# Altium schematic sheet High_Side_FETs.SchDoc
size A4; Organization: TESLA Motors, INC; Address1: 3500 Deer Creek Road; Address2: Palo Alto, CA; Address4: U.S.A.; SheetNumber: 5; SheetTotal: 8
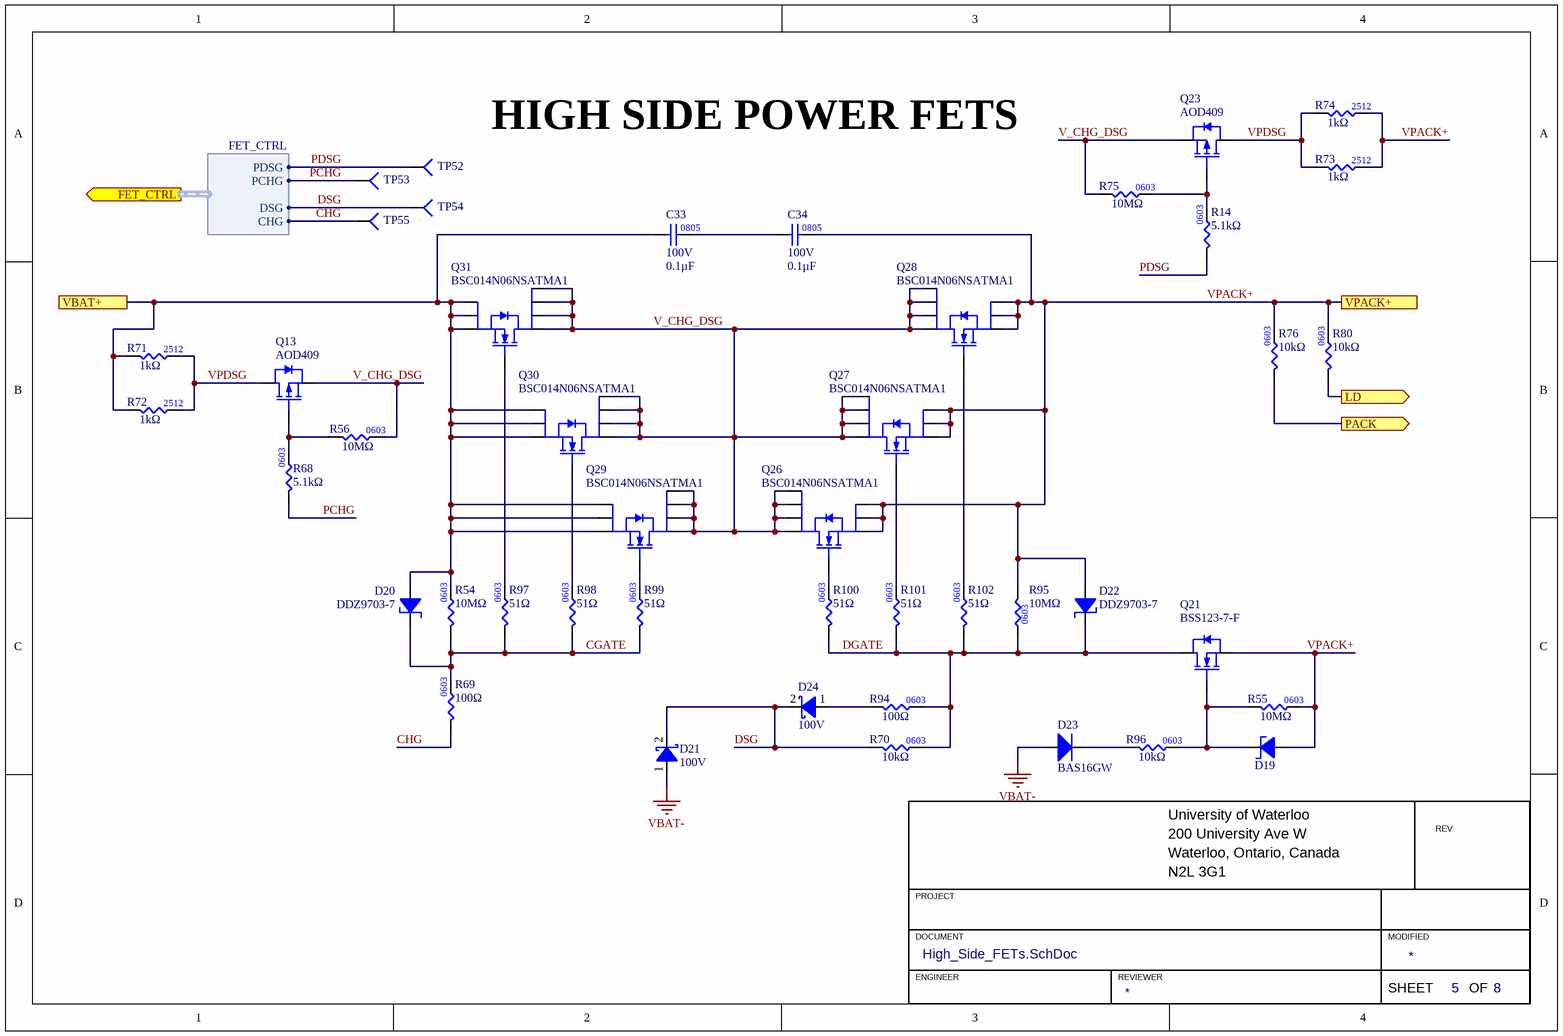
[diagram p0: High_Side_FETs.SchDoc]

## Parts
C33  value 0.1µF  Voltage Rating: 100V  [CAP0805]  (hidden comment: CAP_0.1uF_100V_0805)
C34  value 0.1µF  Voltage Rating: 100V  [CAP0805]  (hidden comment: CAP_0.1uF_100V_0805)
D19  DIO_ZENER_16V  [SOD-123_FLAT]  (value not drawn)
D20  Manufacturer Part Number 1: DDZ9703-7  [SOD-123_FLAT]  (hidden comment: DIO_ZENER_16V)
D21  Vr (Max): 100V  [SOD-123_FLAT]  (hidden comment: DIO_SCHOTTKY_100V_1A)
D22  Manufacturer Part Number 1: DDZ9703-7  [SOD-123_FLAT]  (hidden comment: DIO_ZENER_16V)
D23  Manufacturer Part Number 1: BAS16GW  [DIODSOD-123]  (hidden comment: DIO_100V_215mA)
D24  Vr (Max): 100V  [SOD-123_FLAT]  (hidden comment: DIO_SCHOTTKY_100V_1A)
Q13  Manufacturer Part Number 1: AOD409  [TO-252 AOSMD]  (hidden comment: PMOS_60V_26A)
Q21  Manufacturer Part Number 1: BSS123-7-F  [SOT23-3]  (hidden comment: NMOS_100V_170mA)
Q23  Manufacturer Part Number 1: AOD409  [TO-252 AOSMD]  (hidden comment: PMOS_60V_26A)
Q26  Manufacturer Part Number 1: BSC014N06NSATMA1  [INFINEON_8-POWERTDFN]  (hidden comment: NMOS_60V_30A)
Q27  Manufacturer Part Number 1: BSC014N06NSATMA1  [INFINEON_8-POWERTDFN]  (hidden comment: NMOS_60V_30A)
Q28  Manufacturer Part Number 1: BSC014N06NSATMA1  [INFINEON_8-POWERTDFN]  (hidden comment: NMOS_60V_30A)
Q29  Manufacturer Part Number 1: BSC014N06NSATMA1  [INFINEON_8-POWERTDFN]  (hidden comment: NMOS_60V_30A)
Q30  Manufacturer Part Number 1: BSC014N06NSATMA1  [INFINEON_8-POWERTDFN]  (hidden comment: NMOS_60V_30A)
Q31  Manufacturer Part Number 1: BSC014N06NSATMA1  [INFINEON_8-POWERTDFN]  (hidden comment: NMOS_60V_30A)
R14  value 5.1kΩ  [RES0603]  (hidden comment: RES_5.1kΩ_0603_1%)
R54  value 10MΩ  [RES0603]  (hidden comment: RES_10MΩ_0603_1%)
R55  value 10MΩ  [RES0603]  (hidden comment: RES_10MΩ_0603_1%)
R56  value 10MΩ  [RES0603]  (hidden comment: RES_10MΩ_0603_1%)
R68  value 5.1kΩ  [RES0603]  (hidden comment: RES_5.1kΩ_0603_1%)
R69  value 100Ω  [RES0603]  (hidden comment: RES_100Ω_0603_1%)
R70  value 10kΩ  [RES0603]  (hidden comment: RES_10kΩ_0603_1%)
R71  value 1kΩ  [RES2512]  (hidden comment: RES_1kΩ_2512_1%)
R72  value 1kΩ  [RES2512]  (hidden comment: RES_1kΩ_2512_1%)
R73  value 1kΩ  [RES2512]  (hidden comment: RES_1kΩ_2512_1%)
R74  value 1kΩ  [RES2512]  (hidden comment: RES_1kΩ_2512_1%)
R75  value 10MΩ  [RES0603]  (hidden comment: RES_10MΩ_0603_1%)
R76  value 10kΩ  [RES0603]  (hidden comment: RES_10kΩ_0603_1%)
R80  value 10kΩ  [RES0603]  (hidden comment: RES_10kΩ_0603_1%)
R94  value 100Ω  [RES0603]  (hidden comment: RES_100Ω_0603_1%)
R95  value 10MΩ  [RES0603]  (hidden comment: RES_10MΩ_0603_1%)
R96  value 10kΩ  [RES0603]  (hidden comment: RES_10kΩ_0603_1%)
R97  value 51Ω  [RES0603]  (hidden comment: RES_51Ω_0603_1%)
R98  value 51Ω  [RES0603]  (hidden comment: RES_51Ω_0603_1%)
R99  value 51Ω  [RES0603]  (hidden comment: RES_51Ω_0603_1%)
R100  value 51Ω  [RES0603]  (hidden comment: RES_51Ω_0603_1%)
R101  value 51Ω  [RES0603]  (hidden comment: RES_51Ω_0603_1%)
R102  value 51Ω  [RES0603]  (hidden comment: RES_51Ω_0603_1%)
TP52  TESTPOINT_1MM_CIRCLE  [TESTPOINT_CIRCLE_1MM]  (value not drawn)  (no BOM)
TP53  TESTPOINT_1MM_CIRCLE  [TESTPOINT_CIRCLE_1MM]  (value not drawn)  (no BOM)
TP54  TESTPOINT_1MM_CIRCLE  [TESTPOINT_CIRCLE_1MM]  (value not drawn)  (no BOM)
TP55  TESTPOINT_1MM_CIRCLE  [TESTPOINT_CIRCLE_1MM]  (value not drawn)  (no BOM)

## Ports
FET_CTRL (out, harness FET_CTRL), LD (out), PACK (out), VBAT+, VPACK+

## Harnesses
FET_CTRL: PDSG, PCHG, DSG, CHG

## Nets
VBAT-: D21.1(Anode) D23.1(A)
CGATE: D20.2(Cathode) R54.1 R69.2 R97.1 R98.1 R99.1
CHG: R69.1 TP55.1(=value) ; port FET_CTRL.CHG
DGATE: D22.2(Cathode) Q21.3(DRAIN) R70.2 R94.2 R95.1 R100.1 R101.1 R102.1
DSG: D21.2(Cathode) D24.2(Cathode) R70.1 TP54.1(=value) ; port FET_CTRL.DSG
LD: R80.1 ; port LD
PACK: R76.1 ; port PACK
PCHG: R68.1 TP53.1(=value) ; port FET_CTRL.PCHG
PDSG: R14.1 TP52.1(=value) ; port FET_CTRL.PDSG
V_CHG_DSG: Q13.3(Source) Q23.3(Source) Q26.5(Drain) Q26.6(Drain) Q26.7(Drain) Q26.8(Drain) Q27.5(Drain) Q27.6(Drain) Q27.7(Drain) Q27.8(Drain) Q28.5(Drain) Q28.6(Drain) Q28.7(Drain) Q28.8(Drain) Q29.5(Drain) Q29.6(Drain) Q29.7(Drain) Q29.8(Drain) Q30.5(Drain) Q30.6(Drain) Q30.7(Drain) Q30.8(Drain) Q31.5(Drain) Q31.6(Drain) Q31.7(Drain) Q31.8(Drain) R56.2 R75.1
VBAT+: C33.1 D20.1(Anode) Q29.1(Source) Q29.2(Source) Q29.3(Source) Q30.1(Source) Q30.2(Source) Q30.3(Source) Q31.1(Source) Q31.2(Source) Q31.3(Source) R54.2 R71.1 R72.1 ; port VBAT+
VPACK+: C34.2 D19.1(Anode) D22.1(Anode) Q21.2(SOURCE) Q26.1(Source) Q26.2(Source) Q26.3(Source) Q27.1(Source) Q27.2(Source) Q27.3(Source) Q28.1(Source) Q28.2(Source) Q28.3(Source) R55.2 R73.2 R74.2 R76.2 R80.2 R95.2 ; port VPACK+
VPDSG: Q13.2(Drain) Q23.2(Drain) R71.2 R72.2 R73.1 R74.1
NetC33_2: C33.2 C34.1
NetD19_2: D19.2(Cathode) Q21.1(GATE) R55.1 R96.2
NetD23_2: D23.2(K) R96.1
NetD24_1: D24.1(Anode) R94.1
NetQ13_1: Q13.1(Gate) R56.1 R68.2
NetQ23_1: Q23.1(Gate) R14.2 R75.2
NetQ26_4: Q26.4(Gate) R100.2
NetQ27_4: Q27.4(Gate) R101.2
NetQ28_4: Q28.4(Gate) R102.2
NetQ29_4: Q29.4(Gate) R99.2
NetQ30_4: Q30.4(Gate) R98.2
NetQ31_4: Q31.4(Gate) R97.2

## Notes on the sheet
- HIGH SIDE POWER FETS
- University of Waterloo
- 200 University Ave W
- REV
- PROJECT
- Waterloo, Ontario, Canada
- N2L 3G1
- DOCUMENT
- ENGINEER
- REVIEWER
- MODIFIED
- SHEET
- OF
- (in symbol RES_10MΩ_0603_1%) 0603
- (in symbol RES_51Ω_0603_1%) 0603
- (in symbol RES_100Ω_0603_1%) 0603

## Library data of the parts
C33 C34 = CAP_0.1uF_100V_0805: CAP CER 0.1UF 100V X7R 0805; Manufacturer 1: TDK Corporation; Manufacturer Part Number 1: C2012X7R2A104K125AA; Package: 0805; Supplier 1: Digi-Key; Supplier Part Number 1: 445-1418-1-ND
D19 = DIO_ZENER_16V: DIODE ZENER 16V 500MW SOD123; Manufacturer Part Number 1: DDZ9703-7; Manufacturer 1: Diodes Incorporated; Forward Voltage: 900mV; Supplier 1: Digi-Key; Supplier Part Number 1: DDZ9703-7DICT-ND
D20 D22 = DIO_ZENER_16V: DIODE ZENER 16V 500MW SOD123; Manufacturer 1: Diodes Incorporated; Forward Voltage: 900mV; Supplier 1: Digi-Key; Supplier Part Number 1: DDZ9703-7DICT-ND
D21 D24 = DIO_SCHOTTKY_100V_1A: DIODE SCHOTTKY 100V 1A SOD-123F; Manufacturer 1: SMC Diode Solutions; Manufacturer Part Number 1: DSS110U; Supplier 1: Digi-Key; Supplier Part Number 1: 1655-DSS110UCT-ND; Mounting Type: SMD; Package/Footprint: SOD-123F
D23 = DIO_100V_215mA: DIODE GEN PURP 100V 215MA SOD123; Manufacturer 1: Nexperia; Package/Footprint: SOD-123; Package: SOD-123; Supplier Part Number 1: 1727-7320-1-ND; Supplier 1: Digi-Key; Mounting Type: SMD; Verified: No
Q13 Q23 = PMOS_60V_26A: MOSFET P-CH 60V 26A TO252; Manufacturer 1: Alpha & Omega Semiconductor Inc.; Vgs (Max): ±20V; Vdss: 60V; Mounting Type: SMD; Id: 26A; Supplier 1: Digi-Key; Supplier Part Number 1: 785-1103-1-ND
Q21 = NMOS_100V_170mA: MOSFET N-CH 100V 170MA SOT23-3; Manufacturer 1: Diodes Incorporated; Supplier 1: Digi-Key; Supplier Part Number 1: BSS123-FDICT-ND
Q26-Q31 = NMOS_60V_30A: MOSFET N-CH 60V 30A/100A TDSON7; Manufacturer 1: Infineon Technologies; FET Type: N-Channel; Vgs (Max): 20V; Power Dissipation (Max): 2.5W; Id: 30A; Supplier 1: Digi-Key; Supplier Part Number 1: BSC014N06NSATMA1CT-ND; Vdss: 60V; Supplier Device Package: 8-PowerTDFN
R14 R68 = RES_5.1kΩ_0603_1%: RES 5.1K OHM 1% 1/10W 0603; Manufacturer 1: YAGEO; Manufacturer Part Number 1: RC0603FR-135K1L; Mounting Type: SMD; Package: 0603; Supplier 1: Digi-Key; Supplier Part Number 1: 13-RC0603FR-135K1LCT-ND
R54-R56 R75 R95 = RES_10MΩ_0603_1%: RES 10M OHM 1% 1/10W 0603; Manufacturer 1: YAGEO; Manufacturer Part Number 1: RC0603FR-0710ML; Supplier 1: Digi-Key; Supplier Part Number 1: 311-10.0MHRCT-ND
R69 R94 = RES_100Ω_0603_1%: RES 100 OHM 1% 1/10W 0603; Manufacturer 1: Yageo; Manufacturer Part Number 1: RC0603FR-07100RL; Supplier Part Number 1: 311-100HRCT-ND; Supplier 1: Digi-Key
R70 R76 R80 R96 = RES_10kΩ_0603_1%: RES 10K OHM 1% 1/8W 0603; Manufacturer 1: Stackpole Electronics Inc; Manufacturer Part Number 1: RNCP0603FTD10K0; Supplier Part Number 1: RNCP0603FTD10K0CT-ND; Supplier 1: Digi-Key; Mounting Type: SMD; Package: 0603
R71-R74 = RES_1kΩ_2512_1%: RES SMD 1K OHM 1% 3W 2512; Manufacturer 1: TE Connectivity Passive Product; Manufacturer Part Number 1: 35221K0FT; Supplier Part Number 1: A121161CT-ND; Supplier 1: Digi-Key; Mounting Type: SMD; Package: 2512
R97-R102 = RES_51Ω_0603_1%: RES 51 OHM 1% 1/10W 0603; Manufacturer 1: YAGEO; Manufacturer Part Number 1: RC0603FR-0751RL; Supplier 1: Digi-Key; Supplier Part Number 1: 311-51.0HRCT-ND
TP52-TP55 = TESTPOINT_1MM_CIRCLE: TESTPOINT 1MM CIRCLE